# Altium schematic sheet MK64.SchDoc
size B
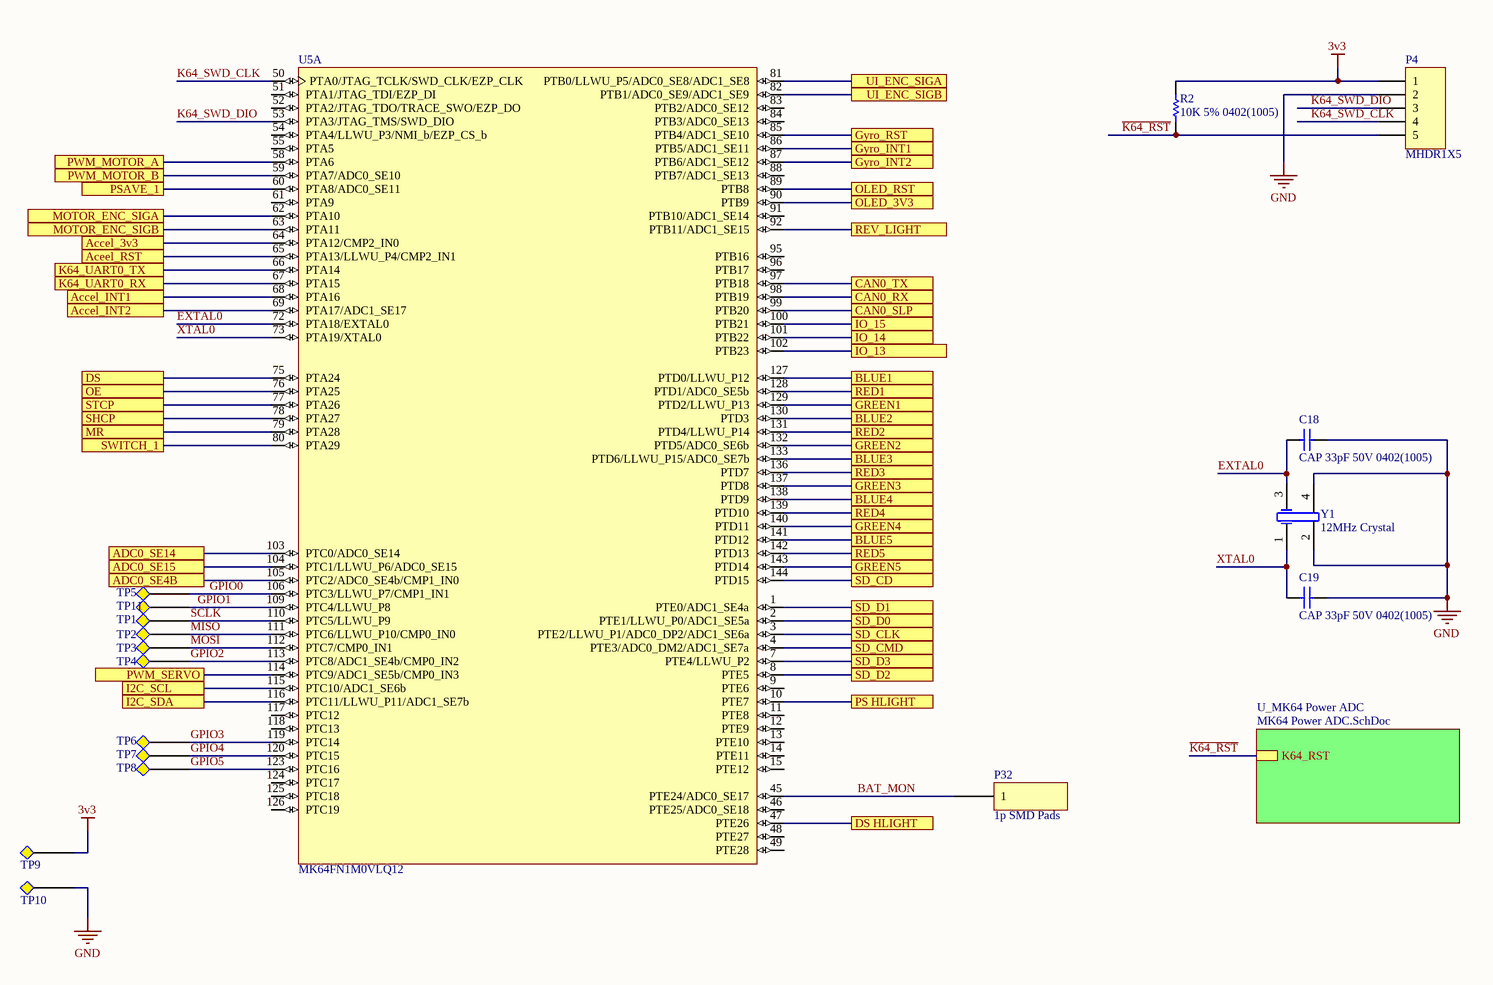
[diagram p0: MK64.SchDoc]

## Parts
C18  CAP 33pF 50V 0402(1005)  [CAPC0402(1005)60_N]
C19  CAP 33pF 50V 0402(1005)  [CAPC0402(1005)60_N]
P4  MHDR1X5  [MHDR1X5]
P32  1p SMD Pads  [1p SMD pad]
R2  10K 5% 0402(1005)  [RESC0402(1005)_N]
TP1  Test Point  [TP]  (value not drawn)  (no BOM)
TP2  Test Point  [TP]  (value not drawn)  (no BOM)
TP3  Test Point  [TP]  (value not drawn)  (no BOM)
TP4  Test Point  [TP]  (value not drawn)  (no BOM)
TP5  Test Point  [TP]  (value not drawn)  (no BOM)
TP6  Test Point  [TP]  (value not drawn)  (no BOM)
TP7  Test Point  [TP]  (value not drawn)  (no BOM)
TP8  Test Point  [TP]  (value not drawn)  (no BOM)
TP9  Test Point  [TP]  (value not drawn)  (no BOM)
TP10  Test Point  [TP]  (value not drawn)  (no BOM)
TP11  Test Point  [TP]  (value not drawn)  (no BOM)
U5  MK64FN1M0VLQ12  [918-03_N]  (part A of 3)
Y1  12MHz Crystal  [DFN155P250X80-4N]

## Sub-sheets
U_MK64 Power ADC = MK64 Power ADC.SchDoc: K64_RST

## Ports
Accel_3v3, Accel_INT1, Accel_INT2, Aceel_RST, ADC0_SE4B, ADC0_SE14, ADC0_SE15, BLUE1, BLUE2, BLUE3, BLUE4, BLUE5, CAN0_RX, CAN0_SLP, CAN0_TX, DS, DS HLIGHT, GREEN1, GREEN2, GREEN3, GREEN4, GREEN5, Gyro_INT1, Gyro_INT2, Gyro_RST, I2C_SCL, I2C_SDA, IO_13, IO_14, IO_15, K64_UART0_RX, K64_UART0_TX, MOTOR_ENC_SIGA, MOTOR_ENC_SIGB, MR, OE, OLED_3V3, OLED_RST, PS HLIGHT, PSAVE_1, PWM_MOTOR_A, PWM_MOTOR_B, PWM_SERVO, RED1, RED2, RED3, RED4, RED5, REV_LIGHT, SD_CD, SD_CLK, SD_CMD, SD_D0, SD_D1, SD_D2, SD_D3, SHCP, STCP, SWITCH_1, UI_ENC_SIGA, UI_ENC_SIGB

## Nets
3v3: P4.1 R2.2 TP9.1
GND: C18.2 C19.2 P4.2 TP10.1 Y1.2(GND) Y1.4(GND)
~{K64_RST}: P4.5 R2.1 ; sheet U_MK64 Power ADC/K64_RST
Accel_3v3: U5.64(PTA12/CMP2_IN0) ; port Accel_3v3
Accel_INT1: U5.68(PTA16) ; port Accel_INT1
Accel_INT2: U5.69(PTA17/ADC1_SE17) ; port Accel_INT2
Aceel_RST: U5.65(PTA13/LLWU_P4/CMP2_IN1) ; port Aceel_RST
ADC0_SE4B: U5.105(PTC2/ADC0_SE4b/CMP1_IN0) ; port ADC0_SE4B
ADC0_SE14: U5.103(PTC0/ADC0_SE14) ; port ADC0_SE14
ADC0_SE15: U5.104(PTC1/LLWU_P6/ADC0_SE15) ; port ADC0_SE15
BAT_MON: P32.1 U5.45(PTE24/ADC0_SE17)
BLUE1: U5.127(PTD0/LLWU_P12) ; port BLUE1
BLUE2: U5.130(PTD3) ; port BLUE2
BLUE3: U5.133(PTD6/LLWU_P15/ADC0_SE7b) ; port BLUE3
BLUE4: U5.138(PTD9) ; port BLUE4
BLUE5: U5.141(PTD12) ; port BLUE5
CAN0_RX: U5.98(PTB19) ; port CAN0_RX
CAN0_SLP: U5.99(PTB20) ; port CAN0_SLP
CAN0_TX: U5.97(PTB18) ; port CAN0_TX
DS: U5.75(PTA24) ; port DS
DS HLIGHT: U5.47(PTE26) ; port DS HLIGHT
EXTAL0: C18.1 U5.72(PTA18/EXTAL0) Y1.3(OSC2)
GPIO0: TP5.1 U5.106(PTC3/LLWU_P7/CMP1_IN1)
GPIO1: TP11.1 U5.109(PTC4/LLWU_P8)
GPIO2: TP4.1 U5.113(PTC8/ADC1_SE4b/CMP0_IN2)
GPIO3: TP6.1 U5.119(PTC14)
GPIO4: TP7.1 U5.120(PTC15)
GPIO5: TP8.1 U5.123(PTC16)
GREEN1: U5.129(PTD2/LLWU_P13) ; port GREEN1
GREEN2: U5.132(PTD5/ADC0_SE6b) ; port GREEN2
GREEN3: U5.137(PTD8) ; port GREEN3
GREEN4: U5.140(PTD11) ; port GREEN4
GREEN5: U5.143(PTD14) ; port GREEN5
Gyro_INT1: U5.86(PTB5/ADC1_SE11) ; port Gyro_INT1
Gyro_INT2: U5.87(PTB6/ADC1_SE12) ; port Gyro_INT2
Gyro_RST: U5.85(PTB4/ADC1_SE10) ; port Gyro_RST
I2C_SCL: U5.115(PTC10/ADC1_SE6b) ; port I2C_SCL
I2C_SDA: U5.116(PTC11/LLWU_P11/ADC1_SE7b) ; port I2C_SDA
IO_13: U5.102(PTB23) ; port IO_13
IO_14: U5.101(PTB22) ; port IO_14
IO_15: U5.100(PTB21) ; port IO_15
K64_SWD_CLK: P4.4 U5.50(PTA0/JTAG_TCLK/SWD_CLK/EZP_CLK)
K64_SWD_DIO: P4.3 U5.53(PTA3/JTAG_TMS/SWD_DIO)
K64_UART0_RX: U5.67(PTA15) ; port K64_UART0_RX
K64_UART0_TX: U5.66(PTA14) ; port K64_UART0_TX
MISO: TP2.1 U5.111(PTC6/LLWU_P10/CMP0_IN0)
MOSI: TP3.1 U5.112(PTC7/CMP0_IN1)
MOTOR_ENC_SIGA: U5.62(PTA10) ; port MOTOR_ENC_SIGA
MOTOR_ENC_SIGB: U5.63(PTA11) ; port MOTOR_ENC_SIGB
MR: U5.79(PTA28) ; port MR
OE: U5.76(PTA25) ; port OE
OLED_3V3: U5.90(PTB9) ; port OLED_3V3
OLED_RST: U5.89(PTB8) ; port OLED_RST
PS HLIGHT: U5.10(PTE7) ; port PS HLIGHT
PSAVE_1: U5.60(PTA8/ADC0_SE11) ; port PSAVE_1
PWM_MOTOR_A: U5.58(PTA6) ; port PWM_MOTOR_A
PWM_MOTOR_B: U5.59(PTA7/ADC0_SE10) ; port PWM_MOTOR_B
PWM_SERVO: U5.114(PTC9/ADC1_SE5b/CMP0_IN3) ; port PWM_SERVO
RED1: U5.128(PTD1/ADC0_SE5b) ; port RED1
RED2: U5.131(PTD4/LLWU_P14) ; port RED2
RED3: U5.136(PTD7) ; port RED3
RED4: U5.139(PTD10) ; port RED4
RED5: U5.142(PTD13) ; port RED5
REV_LIGHT: U5.92(PTB11/ADC1_SE15) ; port REV_LIGHT
SCLK: TP1.1 U5.110(PTC5/LLWU_P9)
SD_CD: U5.144(PTD15) ; port SD_CD
SD_CLK: U5.3(PTE2/LLWU_P1/ADC0_DP2/ADC1_SE6a) ; port SD_CLK
SD_CMD: U5.4(PTE3/ADC0_DM2/ADC1_SE7a) ; port SD_CMD
SD_D0: U5.2(PTE1/LLWU_P0/ADC1_SE5a) ; port SD_D0
SD_D1: U5.1(PTE0/ADC1_SE4a) ; port SD_D1
SD_D2: U5.8(PTE5) ; port SD_D2
SD_D3: U5.7(PTE4/LLWU_P2) ; port SD_D3
SHCP: U5.78(PTA27) ; port SHCP
STCP: U5.77(PTA26) ; port STCP
SWITCH_1: U5.80(PTA29) ; port SWITCH_1
UI_ENC_SIGA: U5.81(PTB0/LLWU_P5/ADC0_SE8/ADC1_SE8) ; port UI_ENC_SIGA
UI_ENC_SIGB: U5.82(PTB1/ADC0_SE9/ADC1_SE9) ; port UI_ENC_SIGB
XTAL0: C19.1 U5.73(PTA19/XTAL0) Y1.1(OSC1)

Not connected (* = marked no-connect by the designer): U5 9(PTE6) 11(PTE8) 12(PTE9) 13(PTE10) 14(PTE11) 15(PTE12) 46(PTE25/ADC0_SE18) 48(PTE27) 49(PTE28) 51(PTA1/JTAG_TDI/EZP_DI) 52(PTA2/JTAG_TDO/TRACE_SWO/EZP_DO) 54(PTA4/LLWU_P3/NMI_b/EZP_CS_b) 55(PTA5) 61(PTA9) 83(PTB2/ADC0_SE12) 84(PTB3/ADC0_SE13) 88(PTB7/ADC1_SE13) 91(PTB10/ADC1_SE14) 95(PTB16) 96(PTB17) 117(PTC12) 118(PTC13) 124(PTC17) 125(PTC18) 126(PTC19)

## Notes on the sheet
- Title
- Size:
- Date:
- Letter
- Number:
- Time:
- Revision:
- Sheet
- of
- Copyright 2019
- Specialized Solutions LLC
- 206 W Lincoln Hwy STE B
- New Haven, IN 46774
- www.specsolns.com <http://www.specsolns.com>
- File:

## Library data of the parts
C18 C19 = CMP-1034-01004-1: CAP 33pF 50V ±5% 0402 (1005 Metric) Thickness 0.6mm SMD; Tolerance: Â±5%; Case-Metric: 1005; Case-EIA: 0402; Rated Voltage: 50 V; Value: 33pF; Technology: SMT; Max Thickness: 0.6 mm
P4 = MHDR1X5: Header, 5-Pin; LatestRevisionDate: 17-Jul-2002; LatestRevisionNote: Re-released for DXP Platform.; Publisher: Altium Limited
P32 = 1p SMD
R2 = CMP-1011-00098-1: 10K 0.063W 5% 0402 (1005 Metric)  SMD; Case-Metric: 1005; Value: 10000.00 Ohm; Case-EIA: 0402; Technology: SMT; Tolerance: 5 %; Power: 0.063 W
TP1-TP11 = TP
U5 = CMP-0182-00046-1: Cortex-M4-based Microcontroller with FPU, 1 MB, 120 MHz, 1.71 to 3.6 V, -40 to 105 degC, 144-Pin QFP (918-03), RoHS, Tray; Manufacturer: Freescale Semiconductor; SRAM: 256 KB; Flash: 1 MB; ComponentLink2URL: http://cache.freescale.com/files/microcontrollers/doc/data_sheet/K64P144M120SF5.pdf?pspll=1; VDD: 1.71 to 3.6 V; PackageDescription: 144-Pin Plastic Quad Flat Package, Body 20 x 20 mm, Pitch 0.5 mm; Temperature Range: -40 to 105 degC; ComponentLink1URL: http://www.freescale.com/; ComponentLink3Description: Package Specification; PartNumber: MK64FN1M0VLQ12; VBAT: 1.71 to 3.6 V; ComponentLink1Description: Manufacturer URL; ComponentLink3URL: http://cache.freescale.com/files/shared/doc/package_info/98ASS23177W.pdf; DatasheetVersion: Rev. 3; PackageVersion: Rev. G; RoHS: TRUE; Mounting Technology: Surface Mount; Packing: Tray; VDDA: 1.71 to 3.6 V; ComponentLink2Description: Datasheet; PartId: 1
Y1 = 403C11E16M00000: CRYSTAL 12.0000MHZ 20PF SMD 3.20x2.50; Published: 8-Jun-2000; LatestRevisionDate: 17-Jul-2002; LatestRevisionNote: Re-released for DXP Platform.; PackageReference: R38; Publisher: Altium Limited; PackageDescription: Crystal, Thru-Hole; 2 Leads; Body 3.1 x 8.2 mm (Dia.xH)